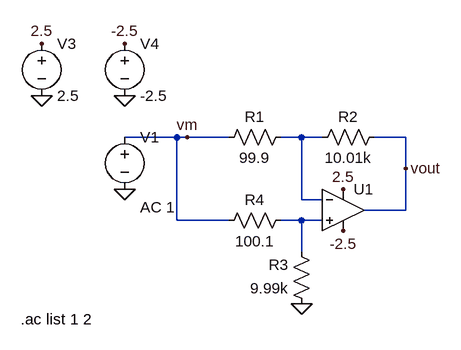
[diagram p0: schematic diff_amp.asc]
diff_amp.asc, the LTspice schematic file:
Version 4
SHEET 1 880 680
WIRE 0 48 -80 48
WIRE 16 48 0 48
WIRE 80 48 16 48
WIRE 192 48 160 48
WIRE 224 48 192 48
WIRE 352 48 304 48
WIRE 352 96 352 48
WIRE 192 144 192 48
WIRE 224 144 192 144
WIRE 352 160 352 96
WIRE 352 160 288 160
WIRE 0 176 0 48
WIRE 80 176 0 176
WIRE 192 176 160 176
WIRE 224 176 192 176
WIRE 192 224 192 176
FLAG 192 304 0
FLAG -80 128 0
FLAG -80 -16 0
FLAG -208 -16 0
FLAG -208 -96 2.5
FLAG -80 -96 -2.5
FLAG 256 128 2.5
FLAG 256 192 -2.5
FLAG 16 48 vm
FLAG 352 96 vout
SYMBOL Opamps\\UniversalOpamp2 256 160 R0
SYMATTR InstName U1
SYMATTR SpiceModel level.1
SYMATTR Value2 Avol=10Meg GBW=1Meg Slew=10Meg
SYMBOL res 176 32 R90
WINDOW 0 0 56 VBottom 2
WINDOW 3 32 56 VTop 2
SYMATTR InstName R1
SYMATTR Value 99.9
SYMBOL res 320 32 R90
WINDOW 0 0 56 VBottom 2
WINDOW 3 32 56 VTop 2
SYMATTR InstName R2
SYMATTR Value 10.01k
SYMBOL res 208 320 R180
WINDOW 0 36 76 Left 2
WINDOW 3 36 40 Left 2
SYMATTR InstName R3
SYMATTR Value 9.99k
SYMBOL res 64 192 R270
WINDOW 0 32 56 VTop 2
WINDOW 3 0 56 VBottom 2
SYMATTR InstName R4
SYMATTR Value 100.1
SYMBOL voltage -80 32 R0
WINDOW 123 24 124 Left 2
WINDOW 39 0 0 Left 0
SYMATTR Value2 AC 1
SYMATTR InstName V1
SYMATTR Value ""
SYMBOL voltage -208 -112 R0
WINDOW 123 0 0 Left 0
WINDOW 39 0 0 Left 0
SYMATTR InstName V3
SYMATTR Value 2.5
SYMBOL voltage -80 -112 R0
WINDOW 123 0 0 Left 0
WINDOW 39 0 0 Left 0
SYMATTR InstName V4
SYMATTR Value -2.5
TEXT -240 328 Left 2 !.ac list 1 2

The netlist it stands for:
* diff_amp.asc
XU1 N002 N001 2.5 -2.5 vout level.1 Avol=10Meg GBW=1Meg Slew=10Meg ilimit=25m rail=0 Vos=0 phimargin=45 en=0 enk=0 in=0 ink=0 Rin=500Meg  ; pins IN+ IN- V+ V- OUT
R1 N001 vm 99.9
R2 vout N001 10.01k
R3 0 N002 9.99k
R4 vm N002 100.1
V1 vm 0 AC 1
V3 2.5 0 2.5
V4 -2.5 0 -2.5
.ac list 1 2
.lib UniversalOpamps2.sub
.backanno
.end